# EAGLE design MRF24_Module (EAGLE 6.3)
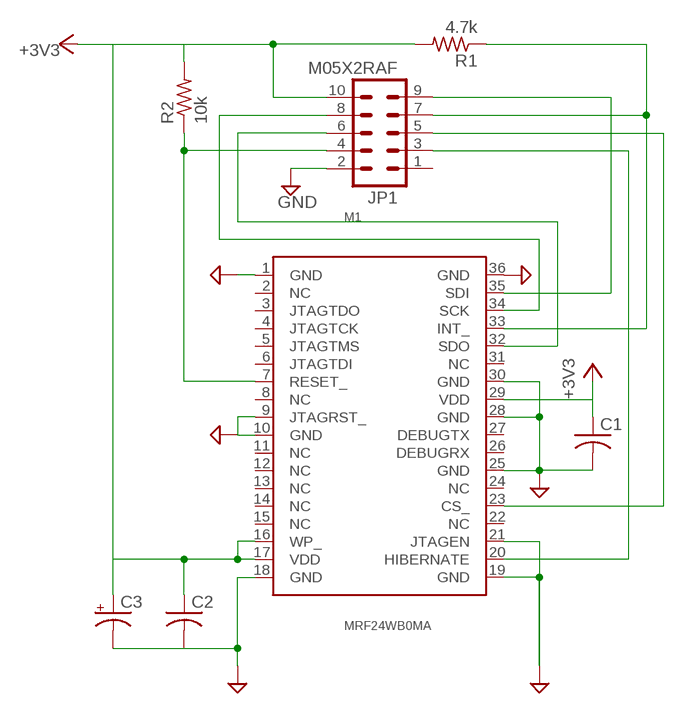
[diagram p0: schematic, sheet 1]

## Parts
C1  C-USC0805  [C0805]
C2  C-USC0805  [C0805]
C3  CPOL-USR/2012-12R  [R/2012-12R]
JP1  M05X2RAF  [2X5-RAF]
M1  MRF24WB0MA  MR24WB0MA  [MRF24W]
R1  4.7k  R-US_R0603  [R0603]
R2  10k  R-US_R0603  [R0603]

## Nets
+3V3: C1.1 C2.1 C3.+ JP1.10 M1.16(WP_) M1.17(VDD) M1.29(VDD) R1.2 R2.2
CS_: JP1.5 M1.23(CS_)
GND: C1.2 C2.2 C3.- JP1.2 M1.1(GND) M1.9(JTAGRST_) M1.10(GND) M1.18(GND) M1.19(GND) M1.21(JTAGEN) M1.25(GND) M1.28(GND) M1.30(GND) M1.36(GND)
HIBER: JP1.3 M1.20(HIBERNATE)
INT_: JP1.7 M1.33(INT_) R1.1
RESET_: JP1.4 M1.7(RESET_) R2.1
SCK: JP1.8 M1.34(SCK)
SDI: JP1.9 M1.35(SDI)
SDO: JP1.6 M1.32(SDO)
Unconnected: JP1.1 M1.2(NC) M1.3(JTAGTDO) M1.4(JTAGTCK) M1.5(JTAGTMS) M1.6(JTAGTDI) M1.8(NC) M1.11(NC) M1.12(NC) M1.13(NC) M1.14(NC) M1.15(NC) M1.22(NC) M1.24(NC) M1.26(DEBUGRX) M1.27(DEBUGTX) M1.31(NC)

## Library data of the parts
C1 C2 = rcl:C-US: CAPACITOR, American symbol
C3 = rcl:CPOL-US: POLARIZED CAPACITOR, American symbol
JP1 = wifi_WX:M05X2: Header 5x2 Standard 10-pin dual row 0.1" header. Commonly used with AVR-ISP. Use with Spark Fun Electronics SKU: PRT-00778
M1 = 1AA_Stofer:MR24WB0MA: Mirochip/ZeroG Wifi module
R1 R2 = rcl:R-US_: RESISTOR, American symbol

## Board
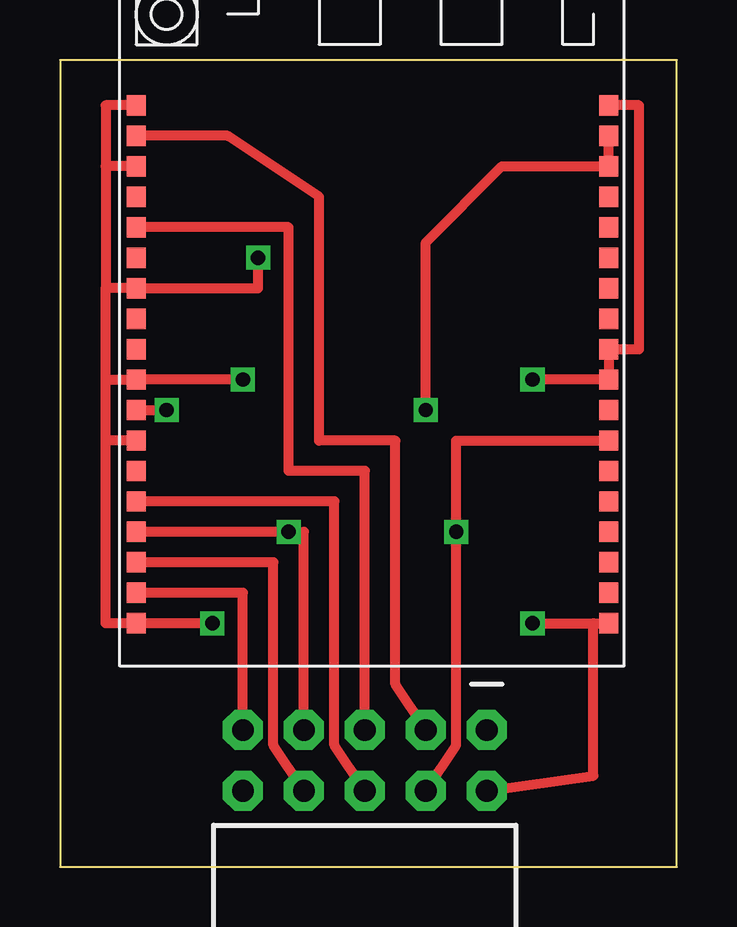
[diagram p1: board, top side]
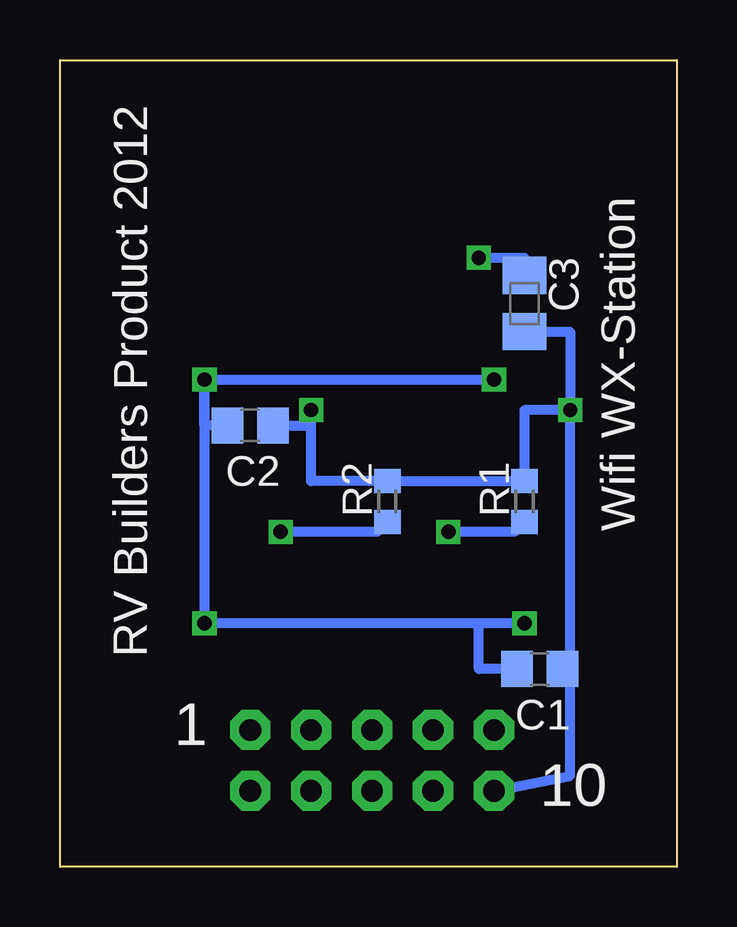
[diagram p2: board, bottom side, seen from below]

Size 25.71 x 33.64 mm. Coordinates in mm from the lower left corner, seen from the top.
Outline: 0,0 25.71,0 25.71,33.64 0,33.64 0,0
Copper layers (1*16): Top 0.035mm / dielectric 1.5mm / Bottom 0.035mm
Design rules "default *": minimum track width 10mil, minimum drill 23mil, track to track 8mil, track to pad 8mil, pad to pad 8mil, via to via 8mil, smd to smd 8mil, copper to edge 40mil, drill to drill 8mil, minimum pad ring 10mil, minimum via ring 8mil, stop-mask expansion 4mil, vias tented up to drill 0mil, thermal gap 10mil

### Footprints (pad centres in the part's own frame; a part is rotated, then mirrored left to right if it is on the bottom)
C0805 = smd 1.3 x 1.5: 1 -0.95,0; 2 0.95,0
R/2012-12R = smd 1.55 x 1.8: + 1.175,0; - -1.175,0
2X5-RAF = drill 0.9 pad 1.676 octagon: 1 -1.27,5.08; 2 1.27,5.08; 3 -1.27,2.54; 4 1.27,2.54; 5 -1.27,0; 6 1.27,0; 7 -1.27,-2.54; 8 1.27,-2.54; 9 -1.27,-5.08; 10 1.27,-5.08
MRF24W = smd 0.8 x 0.85: 1 0.635,29.21; 2 0.635,27.94; 3 0.635,26.67; 4 0.635,25.4; 5 0.635,24.13; 6 0.635,22.86; 7 0.635,21.59; 8 0.635,20.32; 9 0.635,19.05; 10 0.635,17.78; 11 0.635,16.51; 12 0.635,15.24; 13 0.635,13.97; 14 0.635,12.7; 15 0.635,11.43; 16 0.635,10.16; 17 0.635,8.89; 18 0.635,7.62; 19 20.32,7.62; 20 20.32,8.89; 21 20.32,10.16; 22 20.32,11.43; 23 20.32,12.7; 24 20.32,13.97; 25 20.32,15.24; 26 20.32,16.51; 27 20.32,17.78; 28 20.32,19.05; 29 20.32,20.32; 30 20.32,21.59; 31 20.32,22.86; 32 20.32,24.13; 33 20.32,25.4; 34 20.32,26.67; 35 20.32,27.94; 36 20.32,29.21
R0603 = smd 1 x 1.1: 1 -0.85,0; 2 0.85,0

### Placement (x,y rotation side)
C1  5.71,8.25 180 bottom
C2  17.78,18.41 180 bottom
C3  6.35,23.49 270 bottom
JP1  12.7,4.44 270 top
M1  23.5,39.37 180 top
R1  6.35,15.24 90 bottom
R2  12.07,15.24 90 bottom

### Tracks (layer width: path | path; a pad name or v marks a point on that pad's centre or on a via)
+3V3  (via drill 0.6)
  Top 0.406: M1.29 v4.45,19.05 | v15.24,19.05 15.24,26.03 18.42,29.21 M1.16 M1.17
  Bottom 0.406: v4.45,19.05 6.35,19.05 R1.2 R2.2 15.24,16.09 15.24,18.41 | JP1.10 4.45,3.81 4.45,8.25 | 4.45,8.25 v4.45,19.05 | 15.24,18.41 v15.24,19.05 | C2.1 15.24,18.41 | C1.1 4.45,8.25 | C3.+ 4.45,22.32 v4.45,19.05
CS_
  Top 0.406: M1.23 9.53,26.67 9.53,16.51 12.7,16.51 JP1.5
GND  (via drill 0.6)
  Top 0.406: JP1.2 22.22,3.81 22.22,10.16 M1.1 v19.68,10.16 | M1.19 1.91,31.75 1.91,29.21 | M1.21 1.91,29.21 | 1.91,29.21 1.91,24.13 | M1.18 24.13,31.75 24.13,21.59 M1.10 M1.9 v19.68,20.32 | 1.91,24.13 M1.25 8.26,24.13 v8.26,25.4 | 1.91,20.32 1.91,24.13 | v6.35,10.16 M1.36 1.91,10.16 1.91,17.78 | M1.30 1.91,17.78 | 1.91,17.78 1.91,20.32 | 1.91,20.32 M1.28 v7.62,20.32
  Bottom 0.406: v6.35,10.16 8.26,10.16 | 8.26,10.16 v19.68,10.16 v19.68,20.32 | v19.68,20.32 v7.62,20.32 | 19.68,19.37 v19.68,20.32 | C2.2 19.68,18.41 v19.68,20.32 | C1.2 8.26,8.25 8.26,10.16 | v8.26,25.4 6.35,25.4 C3.-
HIBER
  Top 0.406: M1.20 6.99,30.48 10.8,27.94 10.8,17.78 13.97,17.78 13.97,7.62 JP1.3
INT_  (via drill 0.6)
  Top 0.406: JP1.7 10.16,13.97 v9.53,13.97 M1.33
  Bottom 0.406: R1.1 6.77,13.97 v9.53,13.97
RESET_  (via drill 0.6)
  Top 0.406: JP1.4 16.51,5.08 v16.51,13.97 16.51,17.78 M1.7
  Bottom 0.406: R2.1 12.49,13.97 v16.51,13.97
SCK
  Top 0.406: JP1.8 8.89,5.08 8.89,12.7 M1.34
SDI
  Top 0.406: JP1.9 7.62,11.43 M1.35
SDO
  Top 0.406: JP1.6 11.43,5.08 11.43,15.24 M1.32

### Text on the board
bNames: RV Builders Product 2012 | Wifi WX-Station | 1 | 10
Drill_legend: Drill legend | Date: 12/12/2012 2:51:15 PM | 0.9000 mm / 35.433 mil | 0.6000 mm / 23.622 mil